# Altium schematic sheet Unified_Root.SchDoc
size A4; Organization: ORGANIZATION; Address1: ADDRESS 1; Address2: ADDRESS 2; Address3: ADDRESS 3; Address4: ADDRESS 4; Revision: -; SheetNumber: 1; SheetTotal: 9; ENG_APP_DATE: --/--/--; DSN_APP_DATE: --/--/--; CHK_APP_DATE: --/--/--
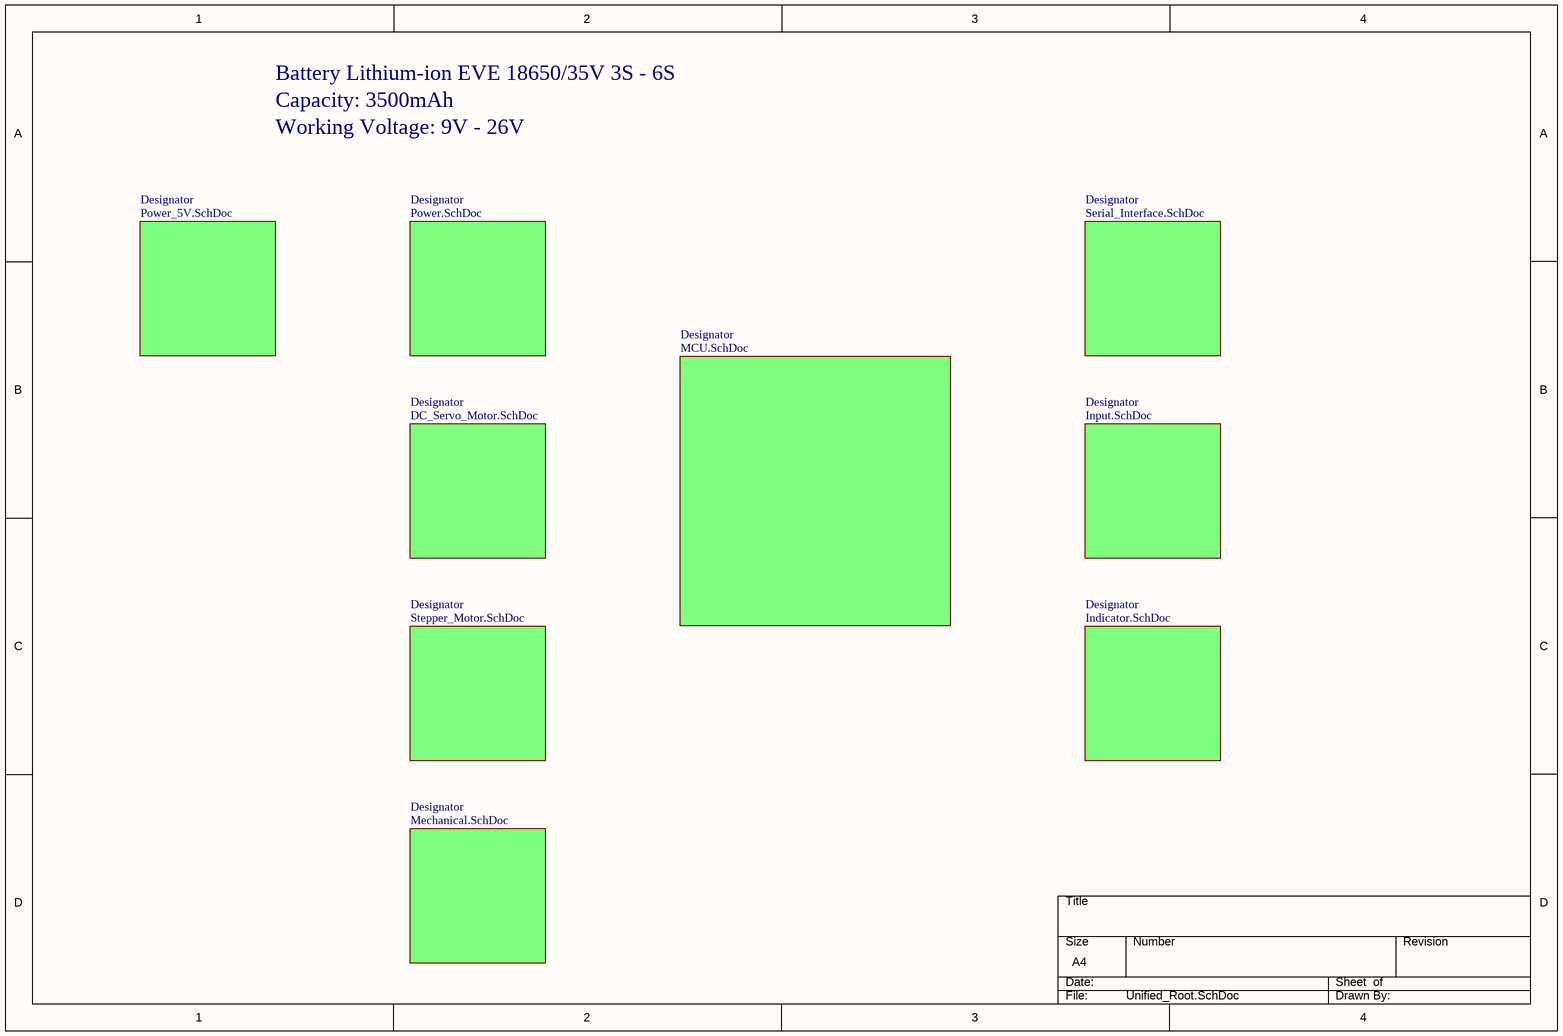
[diagram p0: Unified_Root.SchDoc]

## Sub-sheets
Designator = Power.SchDoc: no entries
Designator = MCU.SchDoc: no entries
Designator = DC_Servo_Motor.SchDoc: no entries
Designator = Stepper_Motor.SchDoc: no entries
Designator = Indicator.SchDoc: no entries
Designator = Input.SchDoc: no entries
Designator = Serial_Interface.SchDoc: no entries
Designator = Mechanical.SchDoc: no entries
Designator = Power_5V.SchDoc: no entries

## Notes on the sheet
- Battery Lithium-ion EVE 18650/35V 3S - 6S
- Capacity: 3500mAh
- Working Voltage: 9V - 26V